# EasyEDA Pro project ProPrj_IRIS_2026-05-03.epro, schematic ESC_Schematic
Create Date: 2026-05-03; Page Name: P1; Project Name: IRIS_V2.1; Schematic Name: ESC_Schematic; Update Date: 2026-05-03; Company: EasyEDA.com; Page Size: A4; Version: V1.0
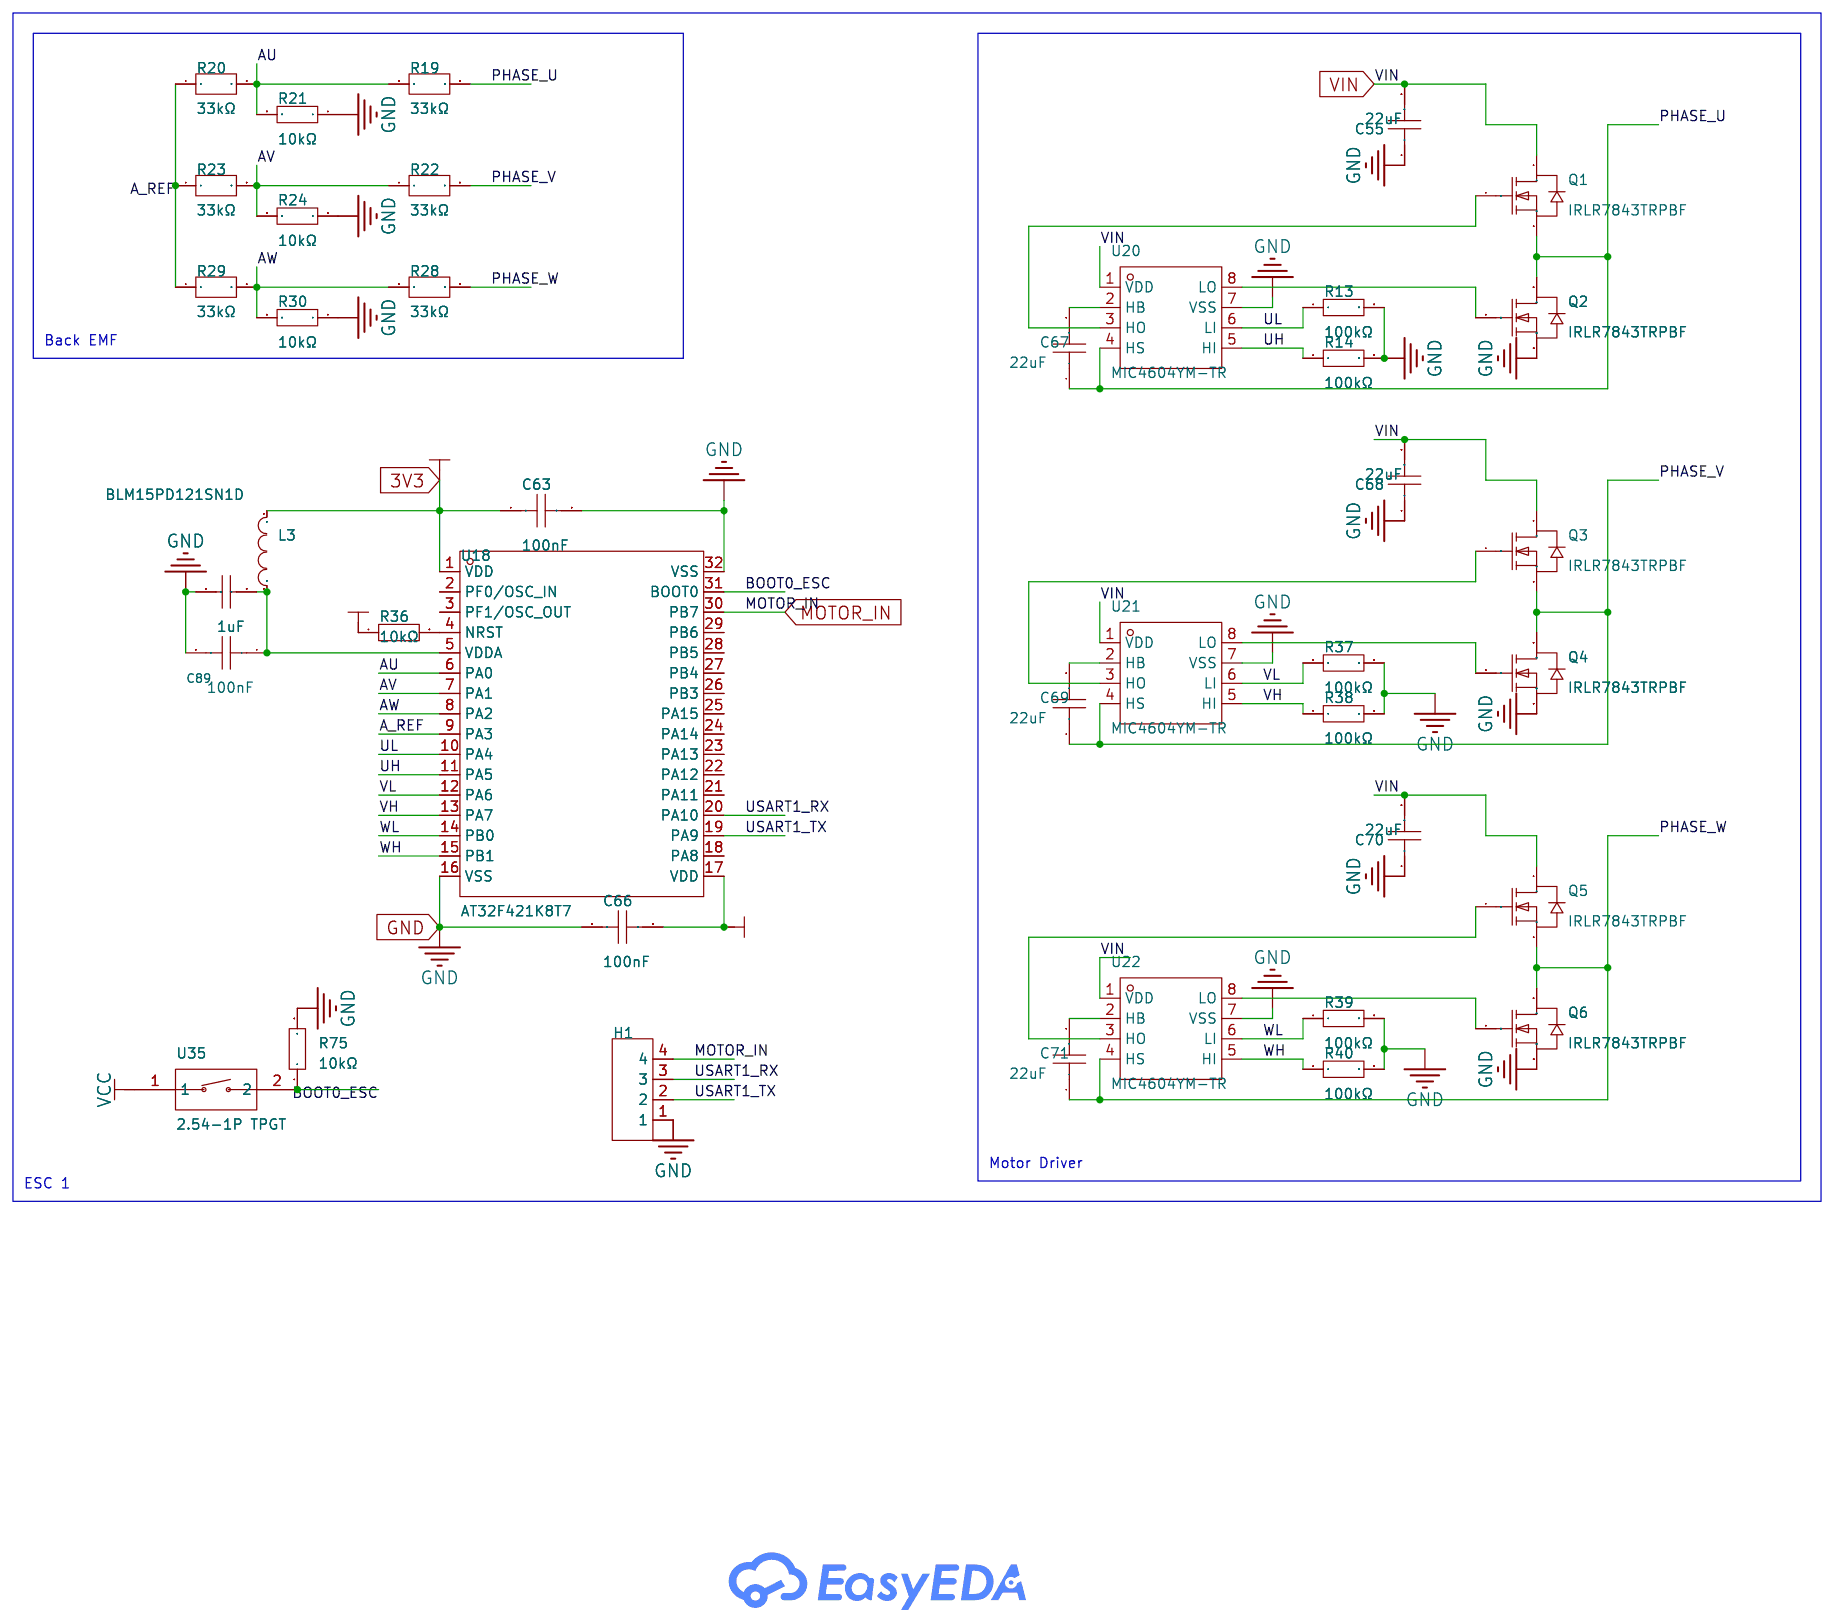
[diagram p0: schematic sheet]

## Parts
C55  22uF  [C0805]
C63  100nF  [C0402]
C66  100nF  [C0402]
C67  22uF  [C0805]
C68  22uF  [C0805]
C69  22uF  [C0805]
C70  22uF  [C0805]
C71  22uF  [C0805]
C89  100nF  [C0402]
C?#1  1uF  [C0402]
H1  HX PH254-01-04-Z-L11.5 straight pin header  [HDR-TH_4P-HX-PH254-01-04-Z-L11.5]
L3  BLM15PD121SN1D  [L0402]
Q1  IRLR7843TRPBF  [TO-252-3_L6.6-W6.1-P4.57-LS9.9-BR-CW]
Q2  IRLR7843TRPBF  [TO-252-3_L6.6-W6.1-P4.57-LS9.9-BR-CW]
Q3  IRLR7843TRPBF  [TO-252-3_L6.6-W6.1-P4.57-LS9.9-BR-CW]
Q4  IRLR7843TRPBF  [TO-252-3_L6.6-W6.1-P4.57-LS9.9-BR-CW]
Q5  IRLR7843TRPBF  [TO-252-3_L6.6-W6.1-P4.57-LS9.9-BR-CW]
Q6  IRLR7843TRPBF  [TO-252-3_L6.6-W6.1-P4.57-LS9.9-BR-CW]
R13  100kΩ  [R0402]
R14  100kΩ  [R0402]
R19  33kΩ  [R0603]
R20  33kΩ  [R0603]
R21  10kΩ  [R0603]
R22  33kΩ  [R0603]
R23  33kΩ  [R0603]
R24  10kΩ  [R0603]
R28  33kΩ  [R0603]
R29  33kΩ  [R0603]
R30  10kΩ  [R0603]
R36  10kΩ  [R0603]
R37  100kΩ  [R0402]
R38  100kΩ  [R0402]
R39  100kΩ  [R0402]
R40  100kΩ  [R0402]
R75  10kΩ  [R0603]
U18  AT32F421K8T7  [LQFP-32_L7.0-W7.0-P0.80-LS9.0-BL]
U20  MIC4604YM-TR  [SOIC-8_L4.9-W3.9-P1.27-LS6.0-BL]
U21  MIC4604YM-TR  [SOIC-8_L4.9-W3.9-P1.27-LS6.0-BL]
U22  MIC4604YM-TR  [SOIC-8_L4.9-W3.9-P1.27-LS6.0-BL]
U35  2.54-1P TPGT  [SW-SMD_2P-L6.2-W2.5-LS9.4]

## Library data of the parts
C55 C67-C71 = CL21A226MAYNNNE: Capacitance:22uF Tolerance:±20% Tolerance:±20% Voltage Rating:25V Temperature Coefficient:X5R; LCSC Part Name: 22uF ±20% 25V; Supplier Part: C602037; Manufacturer: SAMSUNG(三星); Supplier Footprint: 0805; JLCPCB Part Class: Extended Part; Datasheet: https://item.szlcsc.com/datasheet/CL21A226MAYNNNE/631473.html; Supplier: LCSC; Tolerance: ±20%; Voltage Rating: 25V; Temperature Coefficient: X5R
C63 C66 C89 = CC0402X7R25V104KN: Capacitance:100nF Tolerance:±10% Tolerance:±10% Voltage Rating:25V Temperature Coefficient:X7R; LCSC Part Name: 100nF ±10% 25V; Supplier Part: C53084459; Manufacturer: TORCH(火炬); Supplier Footprint: 0402; JLCPCB Part Class: Extended Part; Datasheet: https://item.szlcsc.com/datasheet/CC0402X7R25V104KN/56048924.html; Supplier: LCSC; Tolerance: ±10%; Voltage Rating: 25V; Temperature Coefficient: X7R
C?#1 = CL05A105KO5NNNC: Capacitance:1uF Tolerance:±10% Tolerance:±10% Voltage Rating:16V Temperature Coefficient:X5R; LCSC Part Name: 1uF ±10% 16V; Supplier Part: C29266; Manufacturer: SAMSUNG(三星); Supplier Footprint: 0402; JLCPCB Part Class: Extended Part; Datasheet: https://item.szlcsc.com/datasheet/CL05A105KO5NNNC/30018.html; Supplier: LCSC; Tolerance: ±10%; Voltage Rating: 16V; Temperature Coefficient: X5R
H1 = HX PH254-01-04-Z-L11.5 straight pin header: Pin Structure:1x4P Pitch:2.54mm Circluar Pins/Square Pins:Pin Header Mounting Type:Through Hole Number of Rows:1 Number of Pins:4P Current Rating:3A Voltage Rating (Max):1kV Length of Mating Pin:6mm Insulation Height:2.5mm Length of End Connection Pin:3mm; LCSC Part Name: 1x4P 间距:2.54mm 方针 直插; Supplier Part: C52016392; Manufacturer: hanxia(韩下); Supplier Footprint: 插件,P=2.54mm; JLCPCB Part Class: Extended Part; Datasheet: https://item.szlcsc.com/datasheet/HX%2520PH254-01-04-Z-L11.5%2520straight%2520pin%2520header/54760437.html; Supplier: LCSC; Pin Structure: 1x4P; Pitch: 2.54mm; Circluar Pins/Square Pins: Pin Header; Mounting Type: Through Hole; Number of Rows: 1; Number of Pins: 4P; Current Rating: 3A; Voltage Rating (Max): 1kV; Length of Mating Pin: 6mm; Insulation Height: 2.5mm; Length of End Connection Pin: 3mm; Contact Material: Brass; Contact Plating: Gold; Operating Temperature: -40℃~+105℃
L3 = BLM15PD121SN1D: Impedance @ Frequency:120Ω@100MHz Tolerance:±25% Tolerance:±25% DC Resistance(DCR):90mΩ Current Rating:1.3A Number of Circuits:1 Operating Temperature:-55℃~+125℃ Operating Temperature:-55℃~+125℃; LCSC Part Name: 单路 0402磁珠 阻抗120Ω@100MHz; Supplier Part: C76891; Manufacturer: muRata(村田); Supplier Footprint: 0402; JLCPCB Part Class: Extended Part; Datasheet: https://item.szlcsc.com/datasheet/BLM15PD121SN1D/78018.html; Supplier: LCSC; Impedance @ Frequency: 120Ω@100MHz; Tolerance: ±25%; DC Resistance(DCR): 90mΩ; Current Rating: 1.3A; Number of Circuits: 1; Operating Temperature: -55℃~+125℃
Q1-Q6 = IRLR7843TRPBF_C19268133: Drain to Source Voltage:30V Current - Continuous Drain(Id):150A RDS(on):2.1mΩ@4.5V,25A Pd - Power Dissipation:90W Gate Threshold Voltage (Vgs(th)):1.7V Gate Charge(Qg):80nC Input Capacitance(Ciss):7.032nF Reverse Transfer Capacitance (Crss@Vds):743pF Oper; LCSC Part Name: 耐压:30V 电流:150A; Supplier Part: C19268133; Manufacturer: TECH PUBLIC(台舟); Supplier Footprint: TO-252-3L; Datasheet: https://item.szlcsc.com/datasheet/IRLR7843TRPBF/20526311.html; Supplier: LCSC; Drain to Source Voltage: 30V; Current - Continuous Drain(Id): 150A; RDS(on): 2.1mΩ@4.5V,25A; Pd - Power Dissipation: 90W; Gate Threshold Voltage (Vgs(th)): 1.7V; Gate Charge(Qg): 80nC; Input Capacitance(Ciss): 7.032nF; Reverse Transfer Capacitance (Crss@Vds): 743pF; Operating Temperature: -55℃~+150℃; Output Capacitance(Coss): 898pF
R13 R14 R37-R40 = RC0402FR-07100KL: Type:Thick Film Resistor Resistance:100kΩ Tolerance:±1% Tolerance:±1% Power(Watts):62.5mW Voltage-Supply(Max):50V Temperature Coefficient:±100ppm/℃ Temperature Coefficient:±100ppm/℃ Operating Temperature:-55℃~+155℃ Operating Temperature:-55℃~+155℃; LCSC Part Name: 厚膜电阻 100kΩ ±1% 62.5mW; Supplier Part: C60491; Manufacturer: YAGEO(国巨); Supplier Footprint: 0402; JLCPCB Part Class: Extended Part; Datasheet: https://item.szlcsc.com/datasheet/RC0402FR-07100KL/61543.html; Supplier: LCSC; Type: Thick Film Resistor; Tolerance: ±1%; Power(Watts): 62.5mW; Voltage-Supply(Max): 50V; Temperature Coefficient: ±100ppm/℃; Operating Temperature: -55℃~+155℃
R19 R20 R22 R23 R28 R29 = FRC0603F3302TS: Type:Thick Film Resistor Resistance:33kΩ Tolerance:±1% Tolerance:±1% Power(Watts):100mW Voltage-Supply(Max):75V Temperature Coefficient:±100ppm/℃ Temperature Coefficient:±100ppm/℃ Operating Temperature:-55℃~+155℃ Operating Temperature:-55℃~+155℃; LCSC Part Name: 33kΩ ±1% 100mW 厚膜电阻; Supplier Part: C2907028; Manufacturer: FOJAN(富捷); Supplier Footprint: 0603; JLCPCB Part Class: Extended Part; Supplier: LCSC; Type: Thick Film Resistor; Tolerance: ±1%; Power(Watts): 100mW; Voltage-Supply(Max): 75V; Temperature Coefficient: ±100ppm/℃; Operating Temperature: -55℃~+155℃
R21 R24 R30 R36 R75 = RC0603FR-0710KL: Type:Thick Film Resistors Resistance: Tolerance:±1% Tolerance:±1% Power(Watts): Overload Voltage (Max): Temperature Coefficient:±100ppm/℃ Temperature Coefficient:±100ppm/℃ Operating Temperature Range:-55℃~+155℃ Operating Temperature Range:-55℃~+155℃; LCSC Part Name: 厚膜电阻 10kΩ ±1% 100mW; Supplier Part: C98220; Manufacturer: YAGEO(国巨); Supplier Footprint: 0603; JLCPCB Part Class: Extended Part; Datasheet: https://atta.szlcsc.com/upload/public/pdf/source/20180927/C295883_E8D83085EA81BD7DE0B2B681138C15EE.pdf; Supplier: LCSC; Type: Thick Film Resistors; Tolerance: ±1%; Temperature Coefficient: ±100ppm/℃; Operating Temperature Range: -55℃~+155℃
U18 = AT32F421K8T7_C3029575: Supplier Part: C3029575; Manufacturer: ARTERY(雅特力); Supplier Footprint: LQFP-32(7x7); Datasheet: https://atta.szlcsc.com/upload/public/pdf/source/20210622/C2765098_2C72C7B1BCEA7473D7B0BCEAEE10BC9B.pdf; Supplier: LCSC
U20-U22 = MIC4604YM-TR: Driven Configuration:Half-Bridge Load Type:MOSFET Number of Drivers:2 Current - Output Low(IOL):1A Current - Output High(IOH):1A Voltage - Supply:5.25V~16V Voltage - Supply:5.25V~16V Rise Time:20ns Fall Time:20ns Propagation Delay tpLH:- Propagation Delay; Supplier Part: C628050; Manufacturer: MICROCHIP(美国微芯); Supplier Footprint: SOIC-8; JLCPCB Part Class: Extended Part; Datasheet: https://item.szlcsc.com/datasheet/MIC4604YM-TR/657849.html; Supplier: LCSC; Driven Configuration: Half-Bridge; Load Type: MOSFET; Number of Drivers: 2; Current - Output Low(IOL): 1A; Current - Output High(IOH): 1A; Voltage - Supply: 5.25V~16V; Rise Time: 20ns; Fall Time: 20ns; Features: Under Voltage Protection; Operating Temperature: -40℃~+125℃; Quiescent Current(Iq): 48uA
U35 = 2.54-1P TPGT: Type:Slide, Rocked Circuit:SPST Number of Positions:1 Termination Style:Gull Wing Lead Pitch:2.54mm Current Rating:25mA Voltage Rating:24V Operating Temperature:-30℃~+85℃ Operating Temperature:-30℃~+85℃ Operating Life:2,000 cycles Color:Black; LCSC Part Name: 2.54-1P贴片高推有LOGO编带; Supplier Part: C7421519; Manufacturer: SHOU HAN(首韩); Supplier Footprint: SMD,P=2.54mm; JLCPCB Part Class: Extended Part; Datasheet: https://item.szlcsc.com/datasheet/2.54-1P%2520TPGT/8402822.html; Supplier: LCSC; Type: Slide, Rocked; Circuit: SPST; Number of Positions: 1; Termination Style: Gull Wing; Lead Pitch: 2.54mm; Current Rating: 25mA; Voltage Rating: 24V; Operating Temperature: -30℃~+85℃; Operating Life: 2,000 cycles; Color: Black

## Nets
3V3: C63.1 C66.2 L3.2 R36.1 U18.1(VDD) U18.17(VDD)
GND: C55.1 C63.2 C66.1 C68.1 C70.1 C89.2 C?#1.1 H1.1 Q2.3(S) Q4.3(S) Q6.3(S) R13.2 R14.2 R21.1 R24.1 R30.1 R37.2 R38.2 R39.2 R40.2 R75.2 U18.16(VSS) U18.32(VSS) U20.7(VSS) U21.7(VSS) U22.7(VSS)
VCC: U35.1
VIN: C55.2 C68.2 C70.2 Q1.2(D) Q3.2(D) Q5.2(D) U20.1(VDD) U21.1(VDD) U22.1(VDD)
A_REF: R20.1 R23.1 R29.1 U18.9(PA3)
AU: R19.1 R20.2 R21.2 U18.6(PA0)
AV: R22.1 R23.2 R24.2 U18.7(PA1)
AW: R28.1 R29.2 R30.2 U18.8(PA2)
BOOT0_ESC: R75.1 U18.31(BOOT0) U35.2
MOTOR_IN: H1.4 U18.30(PB7)
PHASE_U: C67.1 Q1.3(S) Q2.2(D) R19.2 U20.4(HS)
PHASE_V: C69.1 Q3.3(S) Q4.2(D) R22.2 U21.4(HS)
PHASE_W: C71.1 Q5.3(S) Q6.2(D) R28.2 U22.4(HS)
UH: R14.1 U18.11(PA5) U20.5(HI)
UL: R13.1 U18.10(PA4) U20.6(LI)
USART1_RX: H1.3 U18.20(PA10)
USART1_TX: H1.2 U18.19(PA9)
VH: R38.1 U18.13(PA7) U21.5(HI)
VL: R37.1 U18.12(PA6) U21.6(LI)
WH: R40.1 U18.15(PB1) U22.5(HI)
WL: R39.1 U18.14(PB0) U22.6(LI)
Net-(C67-2): C67.2 U20.2(HB)
Net-(C69-2): C69.2 U21.2(HB)
Net-(C71-2): C71.2 U22.2(HB)
Net-(C89-1): C89.1 C?#1.2 L3.1 U18.5(VDDA)
Net-(Q1-1): Q1.1(G) U20.3(HO)
Net-(Q2-1): Q2.1(G) U20.8(LO)
Net-(Q3-1): Q3.1(G) U21.3(HO)
Net-(Q4-1): Q4.1(G) U21.8(LO)
Net-(Q5-1): Q5.1(G) U22.3(HO)
Net-(Q6-1): Q6.1(G) U22.8(LO)
Net-(R36-2): R36.2 U18.4(NRST)

Not connected (* = marked no-connect by the designer): U18 2(PF0/OSC_IN) 3(PF1/OSC_OUT) 18(PA8) 21(PA11) 22(PA12) 23(PA13) 24(PA14) 25(PA15) 26(PB3) 27(PB4) 28(PB5) 29(PB6)

## Notes on the sheet
- Back EMF
- Motor Driver
- ESC 1
